# Altium schematic sheet Pass Transistor.SchDoc
size 406 x 304 mm; SheetNumber: 6; SheetTotal: 14
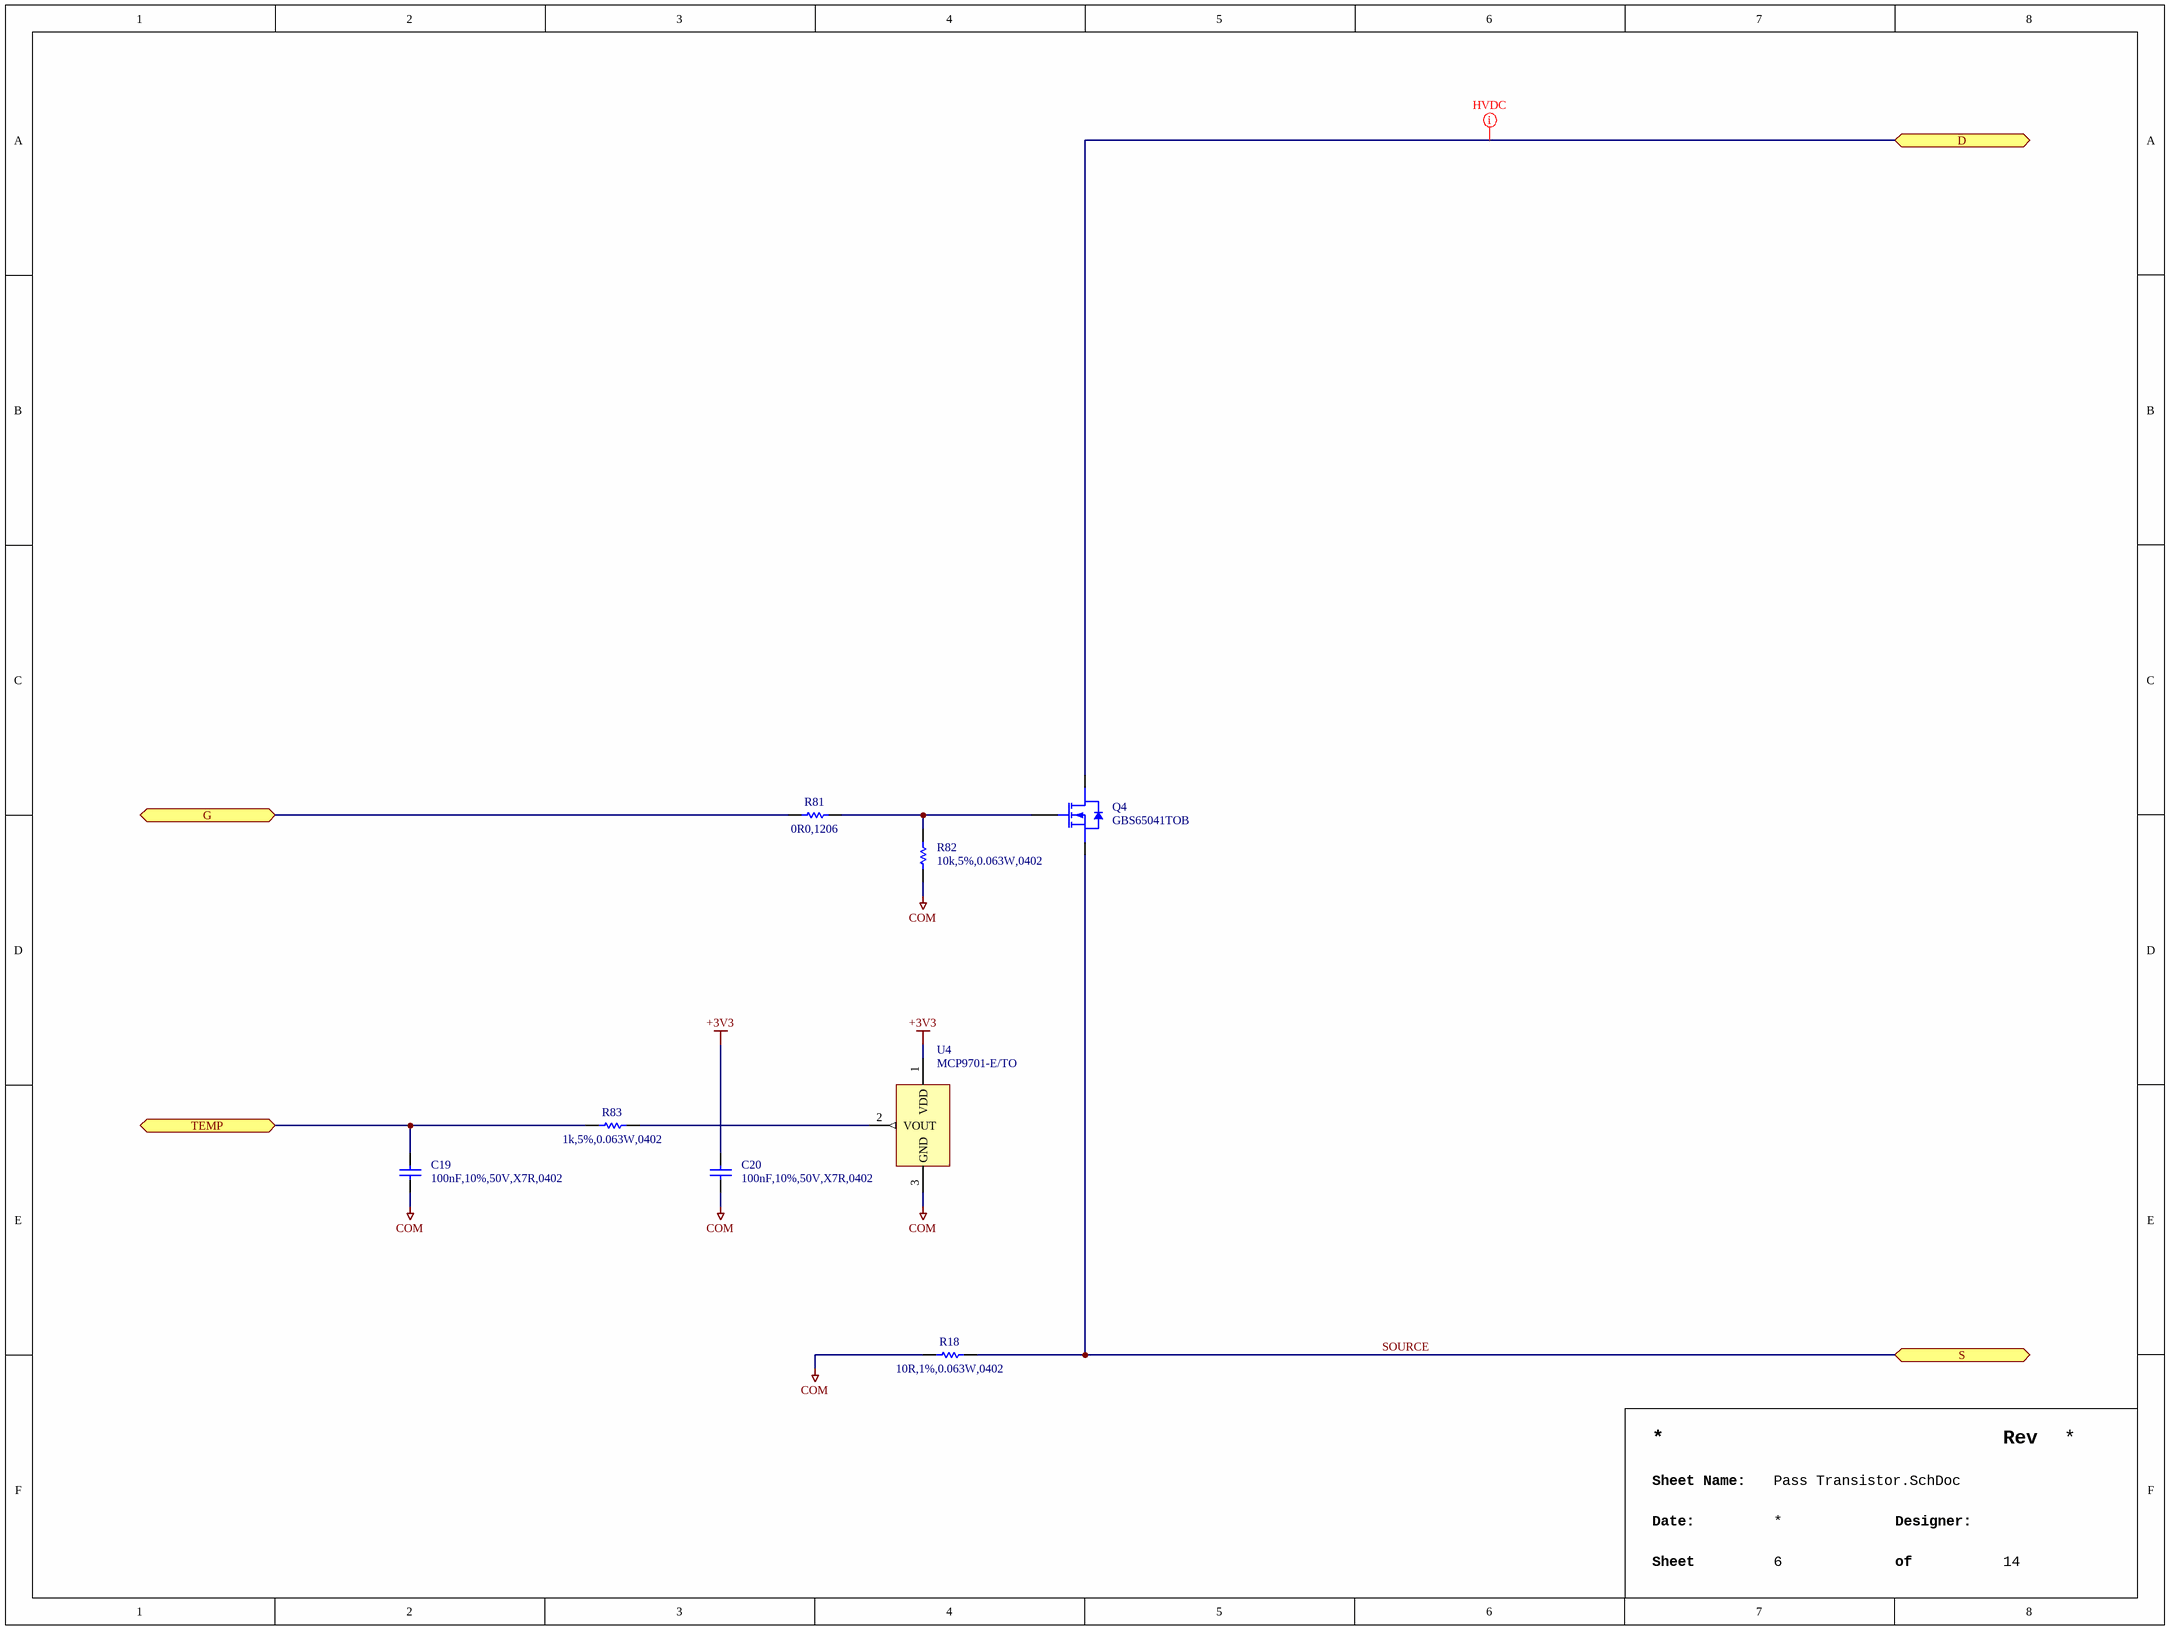
[diagram p0: Pass Transistor.SchDoc]

## Parts
C19  100nF,10%,50V,X7R,0402  [CAPC1005X06N]
C20  100nF,10%,50V,X7R,0402  [CAPC1005X06N]
Q4  GBS65041TOB  [GOSEMICON_PKG_TO-247]
R18  10R,1%,0.063W,0402  [RESC1005X04N]
R81  0R0,1206  [RESC3216X06N]
R82  10k,5%,0.063W,0402  [RESC1005X04N]
R83  1k,5%,0.063W,0402  [RESC1005X04N]
U4  MCP9701-E/TO  [TO-92]

## Ports
D (bidir), G (bidir), S (bidir), TEMP (bidir)

## Nets
+3V3: C20.2 U4.1(VDD)
COM: C19.1 C20.1 R18.1 R82.1 U4.3(GND)
D: Q4.2(D) ; port D
G: R81.1 ; port G
SOURCE: Q4.3(S) R18.2 ; port S
TEMP: C19.2 R83.1 ; port TEMP
NetQ4_1: Q4.1(G) R81.2 R82.2
NetR83_2: R83.2 U4.2(VOUT)

## Layout directives
net class HVDC: D

## Notes on the sheet
- Rev
- Sheet Name:
- Date:
- Sheet
- Designer:
- of

## Library data of the parts
C19 C20 = CAP,Cer,100nF,10%,50V,X7R,0402: 50V 100nF X7R Â±10% 0402 Ceramic Capacitors ROHS; Manufacturer 1: Murata; Manufacturer 1 Part Number: GRM155R71H104KE14D; Vendor 1 Part Number: C77020; Vendor 1: LCSC; Value: 100n; Part Name: CAP,Cer,100nF,10%,50V,X7R,0402; CreatedBy: Judd Foster; HelpURL: https://www.lcsc.com/datasheet/C77020.pdf
Q4 = MOSFET,N Ch,650V,66A: 650V 66A 313W 34mÎ©@10V 4V@1mA 1 N-Channel TO-247 Single FETs, MOSFETs ROHS; Manufacturer 1: GOSEMICON; Vendor 1 Part Number: C5451736; Vendor 1: LCSC; Part Name: MOSFET,N Ch,650V,66A; CreatedBy: Judd Foster; HelpURL: https://www.lcsc.com/datasheet/C5451736.pdf; Manufacturer 1 Part Number: GBS65041TOB
R18 = RES,10R,1%,0.063W,0402: 10 Ohms ï¿½1% 0.063W, 1/16W Chip Resistor 0402 (1005 Metric) Automotive AEC-Q200 Thick Film; Manufacturer 1: Panasonic Electronic Components; Manufacturer 1 Part Number: ERJ-2RKF10R0X; Vendor 1 Part Number: P10.0LCT-ND; Vendor 1: Digikey; Value: 10; Part Name: RES,10R,1%,0.063W,0402; CreatedBy: Judd Foster; HelpURL: https://industrial.panasonic.com/cdbs/www-data/pdf/RDA0000/AOA0000C304.pdf
R81 = RES,0R0,1206: 0 Ohms Jumper Chip Resistor 1206 (3216 Metric) Automotive AEC-Q200 Thick Film; Manufacturer 1: Stackpole Electronics Inc; Manufacturer 1 Part Number: RMCF1206ZT0R00; Vendor 1 Part Number: RMCF1206ZT0R00CT-ND; Vendor 1: Digikey; Value: 0; Part Name: RES,0R0,1206; CreatedBy: Judd Foster; HelpURL: https://www.seielect.com/catalog/sei-rmcf_rmcp.pdf
R82 = RES,10k,5%,0.063W,0402: 10 kOhms ï¿½5% 0.063W, 1/16W Chip Resistor 0402 (1005 Metric) Automotive AEC-Q200 Thick Film; Manufacturer 1: Stackpole Electronics Inc; Manufacturer 1 Part Number: RMCF0402JT10K0; Vendor 1 Part Number: RMCF0402JT10K0CT-ND; Vendor 1: DIgikey; Part Name: RES,10k,5%,0.063W,0402; CreatedBy: Judd Foster; HelpURL: https://www.seielect.com/catalog/sei-rmcf_rmcp.pdf; Value: 10k
R83 = RES,1k,5%,0.063W,0402: 1 kOhms ï¿½5% 0.063W, 1/16W Chip Resistor 0402 (1005 Metric) Automotive AEC-Q200 Thick Film; Manufacturer 1: Stackpole Electronics Inc; Manufacturer 1 Part Number: RMCF0402JT1K00; Vendor 1 Part Number: RMCF0402JT1K00CT-ND; Vendor 1: DIgikey; Part Name: RES,1k,5%,0.063W,0402; CreatedBy: Judd Foster; HelpURL: https://www.seielect.com/catalog/sei-rmcf_rmcp.pdf; Value: 1k
U4 = MCP9701-E/TO: Temperature Sensor Analog, Local -10ï¿½C ~ 125ï¿½C 19.5mV/ï¿½C TO-92-3; Manufacturer 1: Microchip Technology; Vendor 1 Part Number: MCP9701-E/TO-ND; Vendor 1: Digikey; Part Name: MCP9701-E/TO; CreatedBy: Judd Foster; HelpURL: http://ww1.microchip.com/downloads/en/DeviceDoc/20001942G.pdf; Manufacturer 1 Part Number: MCP9701-E/TO